# Altium project Stmandesp.PrjPcb
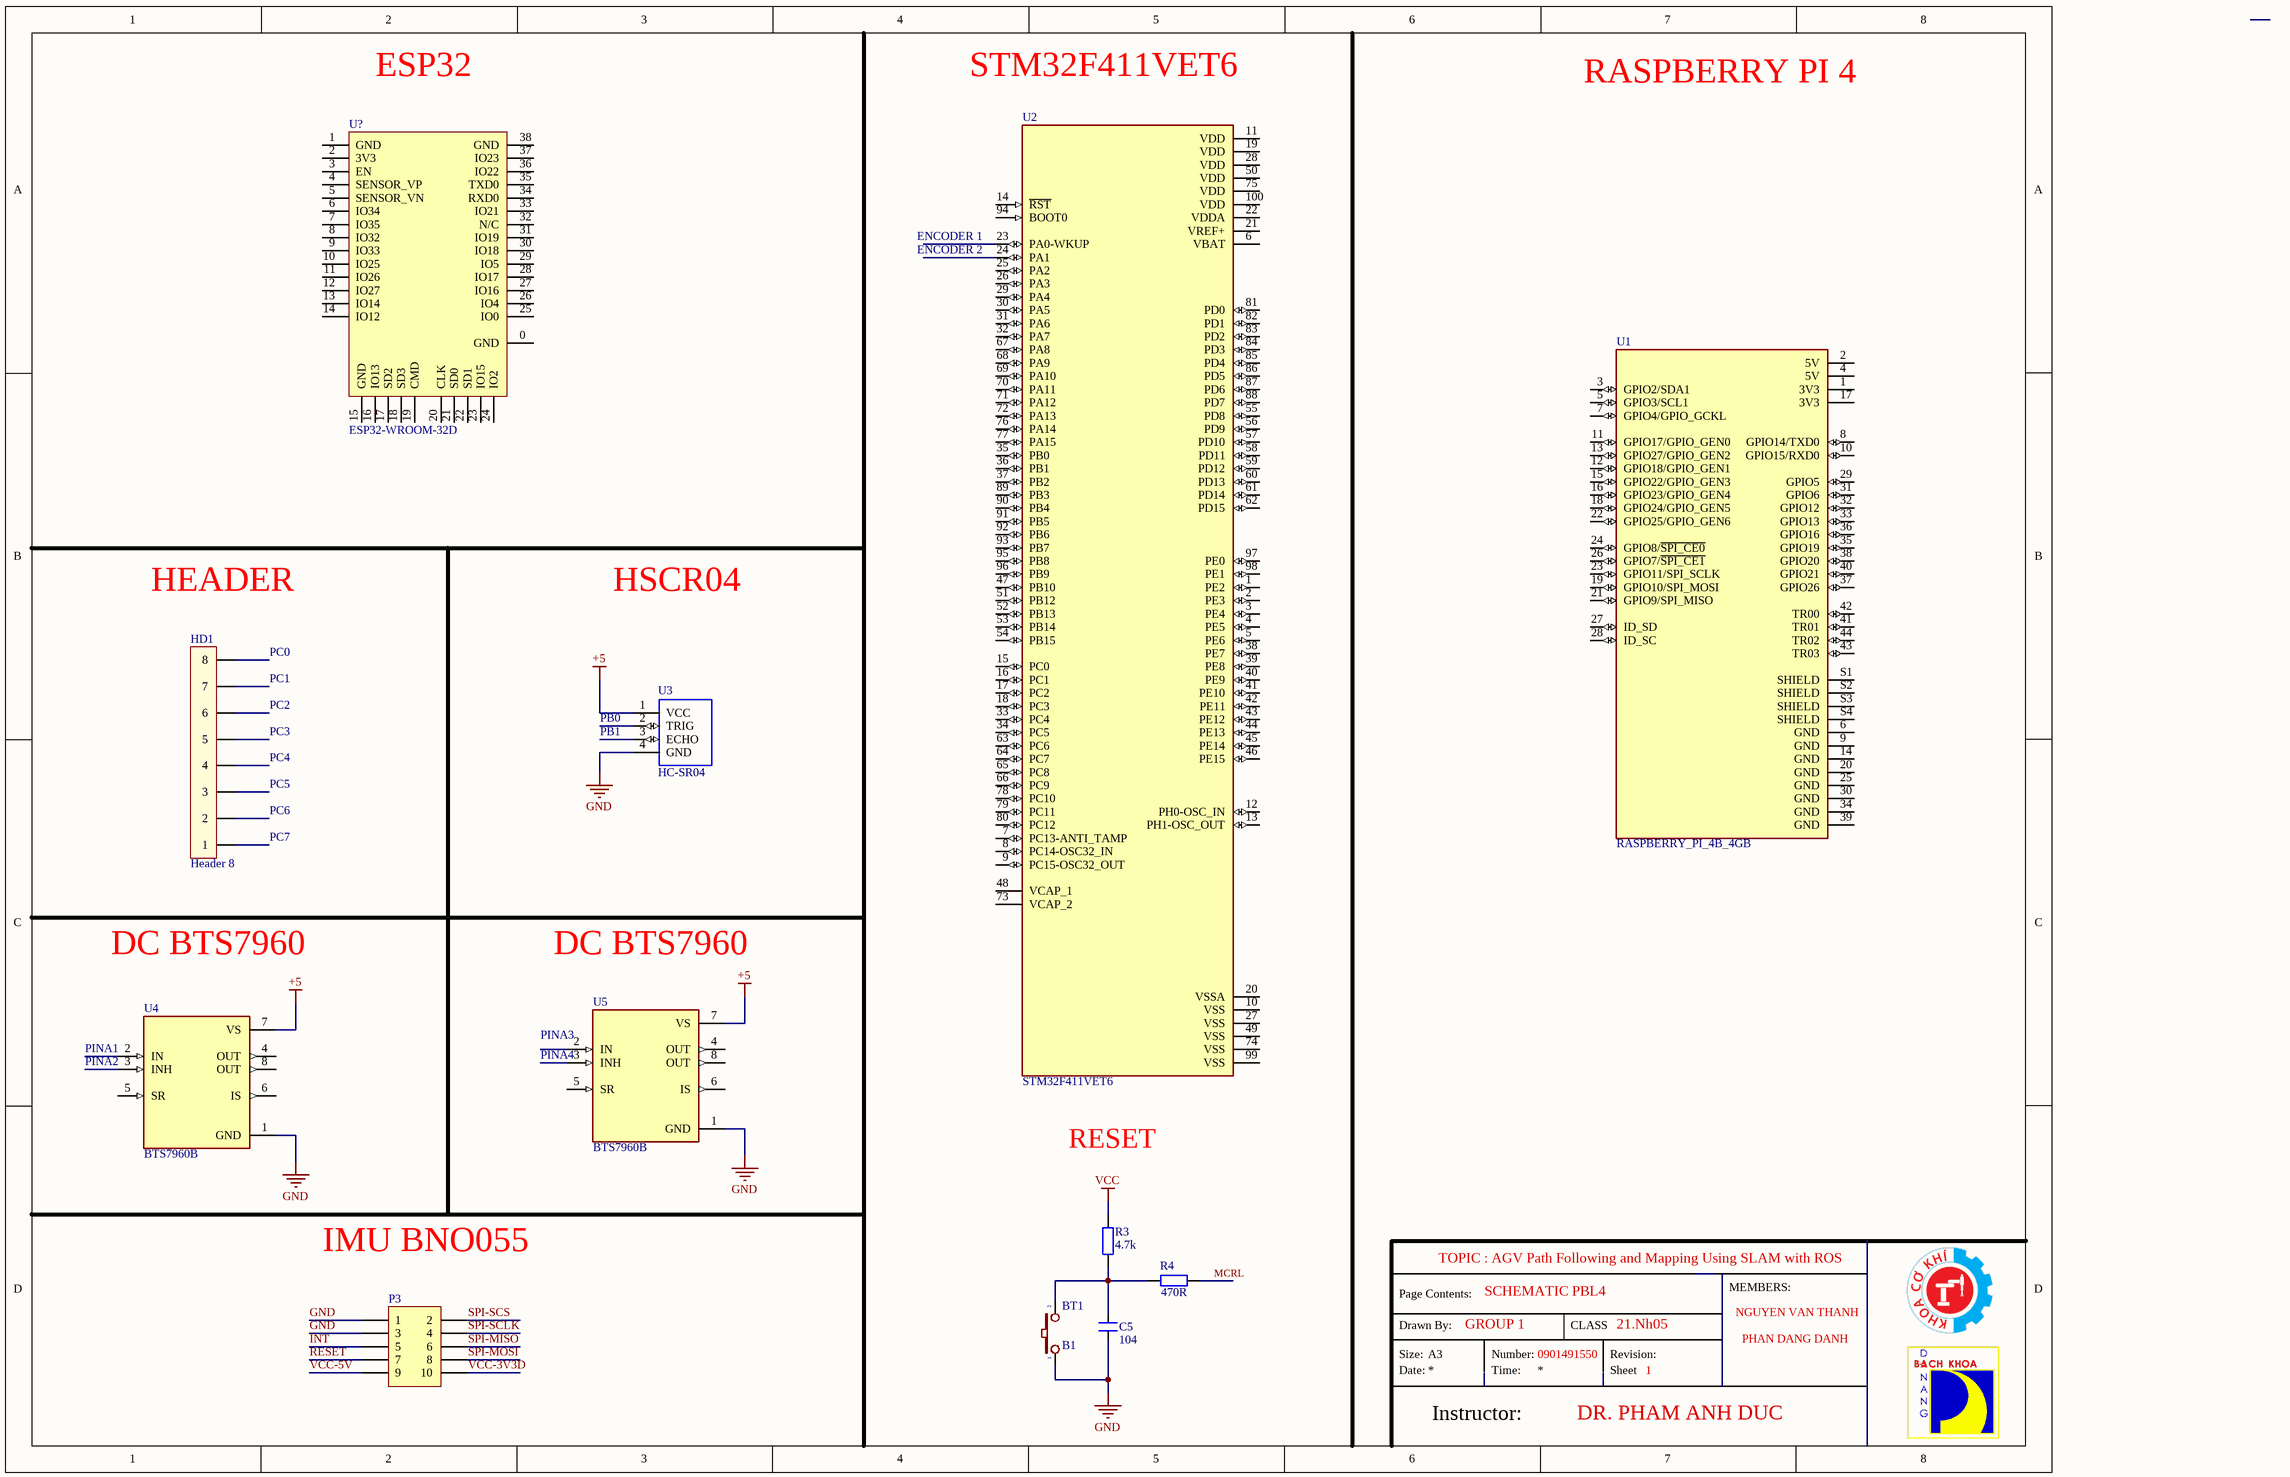
[diagram p0: Sheet3.schdoc]
1 sheet, 12 parts. Net scope: global (net labels, ports and power ports of the same name join across sheets).
Board file: PCB1.PcbDoc

## Sheet Sheet3.schdoc
size A3; SheetNumber: 1; SheetTotal: 1

### Parts
BT1  B1  [SW2]
C5  104  [CN1]
HD1  Header 8  [HED8V]
P3  (no value)  [HDR2X5]
R3  4.7k  [R1/4W]
R4  470R  [R1/4W]
U1  RASPBERRY_PI_4B_4GB  [MODULE_RASPBERRY_PI_4B_4GB]
U2  STM32F411VET6  [QFP50P1600X1600X160-100N]
U3  HC-SR04  [XCVR_HC-SR04]
U4  BTS7960B  [DPAK127P1490X440-8N]
U5  BTS7960B  [DPAK127P1490X440-8N]
U?  ESP32-WROOM-32D  [ESP32-WROOM-32D]

### Nets
+5: U3.1(VCC) U4.7(VS) U5.7(VS)
GND: BT1.1 C5.1 P3.1 P3.3 U3.4(GND) U4.1(GND) U5.1(GND)
VCC: R3.2
INT: P3.5
MCRL: R4.1
RESET: P3.7
SPI-MISO: P3.6
SPI-MOSI: P3.8
SPI-SCLK: P3.4
SPI-SCS: P3.2
VCC-3V3D: P3.10
VCC-5V: P3.9
NetBT1_2: BT1.2 C5.2 R3.1 R4.2

Not connected (* = marked no-connect by the designer): HD1 1 2 3 4 5 6 7 8; U1 1(3V3) 2(5V) 3(GPIO2/SDA1) 4(5V) 5(GPIO3/SCL1) 6(GND) 7(GPIO4/GPIO_GCKL) 8(GPIO14/TXD0) 9(GND) 10(GPIO15/RXD0) 11(GPIO17/GPIO_GEN0) 12(GPIO18/GPIO_GEN1) 13(GPIO27/GPIO_GEN2) 14(GND) 15(GPIO22/GPIO_GEN3) 16(GPIO23/GPIO_GEN4) 17(3V3) 18(GPIO24/GPIO_GEN5) 19(GPIO10/SPI_MOSI) 20(GND) 21(GPIO9/SPI_MISO) 22(GPIO25/GPIO_GEN6) 23(GPIO11/SPI_SCLK) 24(GPIO8/~{SPI_CE0}) 25(GND) 26(GPIO7/~{SPI_CE1}) 27(ID_SD) 28(ID_SC) 29(GPIO5) 30(GND) 31(GPIO6) 32(GPIO12) 33(GPIO13) 34(GND) 35(GPIO19) 36(GPIO16) 37(GPIO26) 38(GPIO20) 39(GND) 40(GPIO21) 41(TR01) 42(TR00) 43(TR03) 44(TR02) S1(SHIELD) S2(SHIELD) S3(SHIELD) S4(SHIELD); U2 1(PE2) 2(PE3) 3(PE4) 4(PE5) 5(PE6) 6(VBAT) 7(PC13-ANTI_TAMP) 8(PC14-OSC32_IN) 9(PC15-OSC32_OUT) 10(VSS) 11(VDD) 12(PH0-OSC_IN) 13(PH1-OSC_OUT) 14(~{RST}) 15(PC0) 16(PC1) 17(PC2) 18(PC3) 19(VDD) 20(VSSA) 21(VREF+) 22(VDDA) 23(PA0-WKUP) 24(PA1) 25(PA2) 26(PA3) 27(VSS) 28(VDD) 29(PA4) 30(PA5) 31(PA6) 32(PA7) 33(PC4) 34(PC5) 35(PB0) 36(PB1) 37(PB2) 38(PE7) 39(PE8) 40(PE9) 41(PE10) 42(PE11) 43(PE12) 44(PE13) 45(PE14) 46(PE15) 47(PB10) 48(VCAP_1) 49(VSS) 50(VDD) 51(PB12) 52(PB13) 53(PB14) 54(PB15) 55(PD8) 56(PD9) 57(PD10) 58(PD11) 59(PD12) 60(PD13) 61(PD14) 62(PD15) 63(PC6) 64(PC7) 65(PC8) 66(PC9) 67(PA8) 68(PA9) 69(PA10) 70(PA11) 71(PA12) 72(PA13) 73(VCAP_2) 74(VSS) 75(VDD) 76(PA14) 77(PA15) 78(PC10) 79(PC11) 80(PC12) 81(PD0) 82(PD1) 83(PD2) 84(PD3) 85(PD4) 86(PD5) 87(PD6) 88(PD7) 89(PB3) 90(PB4) 91(PB5) 92(PB6) 93(PB7) 94(BOOT0) 95(PB8) 96(PB9) 97(PE0) 98(PE1) 99(VSS) 100(VDD); U3 2(TRIG) 3(ECHO); U4 2(IN) 3(INH) 4(OUT) 5(SR) 6(IS) 8(OUT); U5 2(IN) 3(INH) 4(OUT) 5(SR) 6(IS) 8(OUT); U? 0(GND) 1(GND) 2(3V3) 3(EN) 4(SENSOR_VP) 5(SENSOR_VN) 6(IO34) 7(IO35) 8(IO32) 9(IO33) 10(IO25) 11(IO26) 12(IO27) 13(IO14) 14(IO12) 15(GND) 16(IO13) 17(SD2) 18(SD3) 19(CMD) 20(CLK) 21(SD0) 22(SD1) 23(IO15) 24(IO2) 25(IO0) 26(IO4) 27(IO16) 28(IO17) 29(IO5) 30(IO18) 31(IO19) 32(N/C) 33(IO21) 34(RXD0) 35(TXD0) 36(IO22) 37(IO23) 38(GND)

### Notes on the sheet
- ESP32
- STM32F411VET6
- RASPBERRY PI 4
- (near U2) ENCODER 1
- (near U2) ENCODER 2
- HEADER
- HSCR04
- PC0
- PC1
- PC2
- PC3
- PC4
- (near U3) PB0
- (near U3) PB1
- PC5
- PC6
- PC7
- DC BTS7960
- (near U4) PINA1
- (near U4) PINA2
- (near U5) PINA3
- (near U5) PINA4
- RESET
- IMU BNO055
- Page Contents:
- TOPIC : AGV Path Following and Mapping Using SLAM with ROS
- SCHEMATIC PBL4
- MEMBERS:
- Size:
- Date:
- Drawn By:
- A3
- GROUP 1
- Number:
- Time:
- 0901491550
- CLASS
- Revision:
- Sheet
- 21.Nh05
- NGUYEN VAN THANH
- PHAN DANG DANH
- Instructor:
- DR. PHAM ANH DUC

### Library data of the parts
BT1 = SW2: Switch button 2 pin; Value: SW chip 2 pin
C5 = CN0: Cremic For Xtal 1pF => 100pF; Value: 33pF
HD1 = HED8V: Header 8 Vit Broad
P3 = Header 5X2: Header, 5-Pin, Dual row; LatestRevisionDate: 17-Jul-2002; LatestRevisionNote: Re-released for DXP Platform.; Publisher: Altium Limited
R3 R4 = R1/4W: Resistor 1/4W; Value: R1/4W - 1K
U1 = RASPBERRY_PI_4B_4GB: BCM2711 Raspberry Pi 4 Model B 4GB - ARMÂ® CortexÂ®-A72 MPU Embedded Evaluation Board; MP: RASPBERRY PI 4B/4GB; Price: None; MF: Raspberry Pi; Check_prices: https://www.snapeda.com/parts/RASPBERRY%20PI%204B/4GB/Raspberry+Pi/view-part/?ref=eda; Value: *; Purchase-URL: https://pricing.snapeda.com/search/part/RASPBERRY PI 4B/4GB/?ref=eda; Availability: In Stock; SnapEDA_Link: https://www.snapeda.com/parts/RASPBERRY%20PI%204B/4GB/Raspberry+Pi/view-part/?ref=snap; Package: None
U2 = STM32F411VET6: ARMÂ® CortexÂ®-M4 STM32F4 Microcontroller IC 32-Bit 100MHz 512KB _512K x 8_ FLASH 100-LQFP _14x14_; MF: STMicroelectronics; Value: *; Package: LQFP-100 STMicroelectronics; Price: None; MP: STM32F411VET6; Availability: Unavailable; SnapEDA_Link: https://www.snapeda.com/parts/STM32F411VET6/STMicroelectronics/view-part/479547/?ref=snap
U3 = HC-SR04: Ultrasonic Sensor Module; Availability: Unavailable; MP: HC-SR04; Value: *; Price: None; Package: None
U4 U5 = BTS7960B: Half Bridge Driver DC Motors, General Purpose DMOS PG-TO263-7-1; MF: Infineon; Package: TO-263 Infineon; Check_prices: https://www.snapeda.com/parts/BTS7960B/Infineon+Technologies/view-part/?ref=eda; Availability: In Stock; MP: BTS7960B; Value: *; Price: None; SnapEDA_Link: https://www.snapeda.com/parts/BTS7960B/Infineon+Technologies/view-part/?ref=snap